# Altium project CommsBoard.PrjPcb
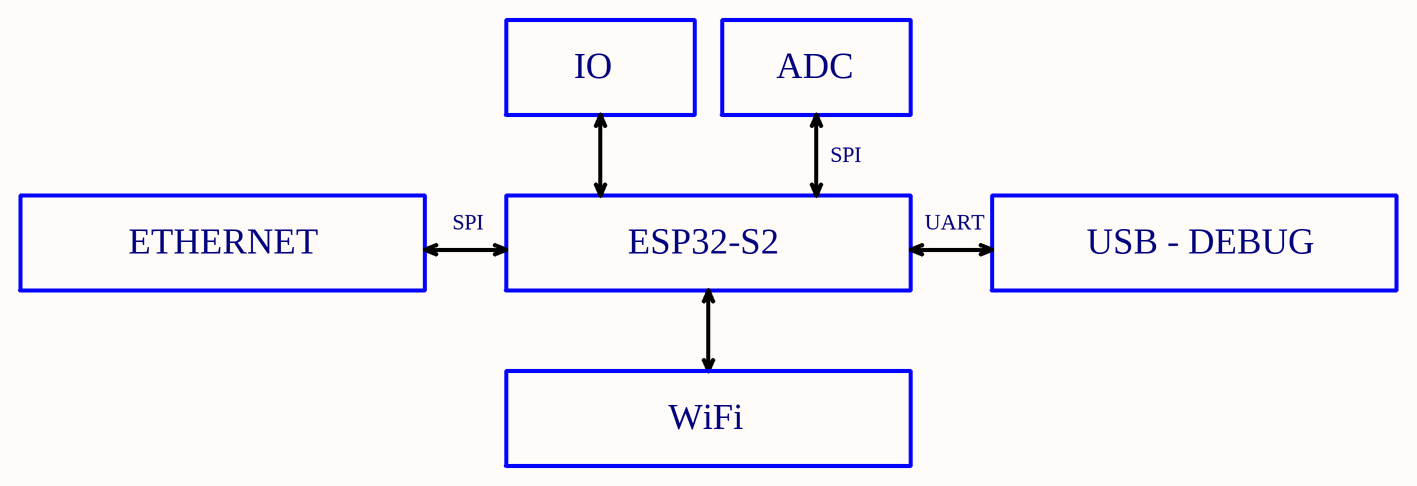
[diagram p0: 01_Block_Diagram.SchDoc]
8 sheets, 168 parts. Net scope: flat (ports and power ports of the same name join across sheets).
Board file: v1.0.PcbDoc
Sheets:
  01_Block_Diagram.SchDoc
  02_Power_Diagram.SchDoc
  03_MCU_ESP32_Interface.SchDoc
  04_ESP32_UART.SchDoc
  05_Ethernet_Interface.SchDoc
  06_Power_Supply.SchDoc
  07_ADC.SchDoc
  08_IO.SchDoc

## Sheet 01_Block_Diagram.SchDoc
size A4; SheetNumber: 1; SheetTotal: 8

### Notes on the sheet
- IO
- ADC
- SPI
- ETHERNET
- ESP32-S2
- UART
- USB - DEBUG
- WiFi

## Sheet 02_Power_Diagram.SchDoc
size A4; SheetNumber: 1; SheetTotal: 8
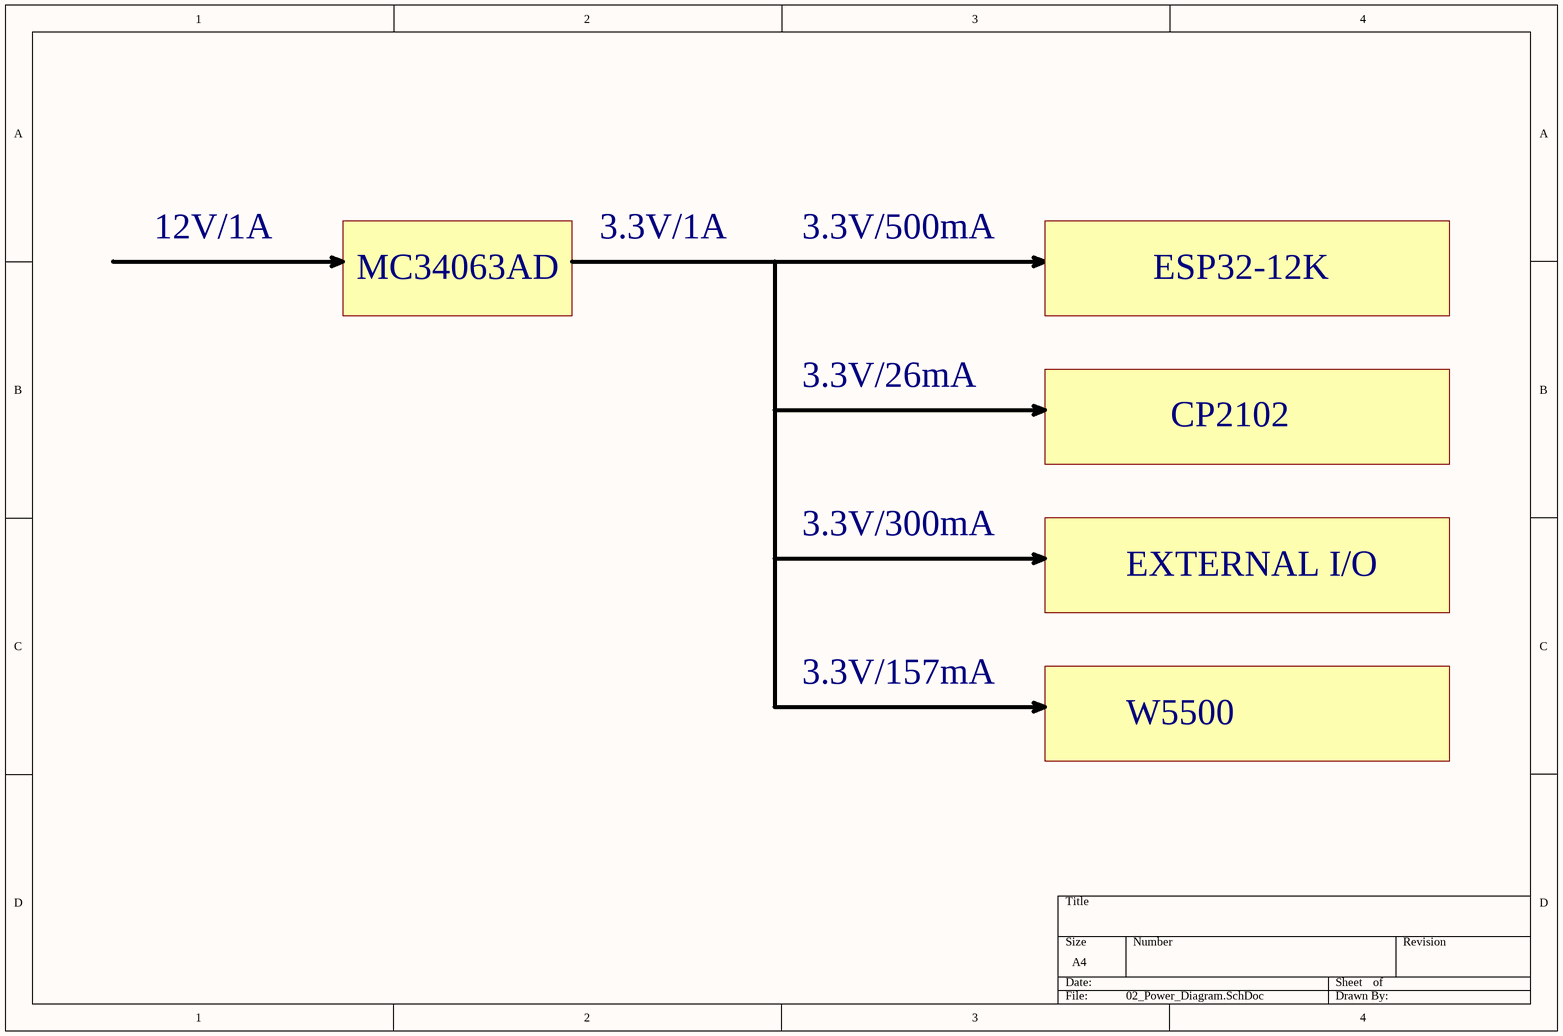
[diagram p1: 02_Power_Diagram.SchDoc]

### Notes on the sheet
- 12V/1A
- 3.3V/1A
- 3.3V/500mA
- MC34063AD
- ESP32-12K
- 3.3V/26mA
- CP2102
- 3.3V/300mA
- EXTERNAL I/O
- 3.3V/157mA
- W5500

## Sheet 03_MCU_ESP32_Interface.SchDoc
size A4; SheetNumber: 4; SheetTotal: 9
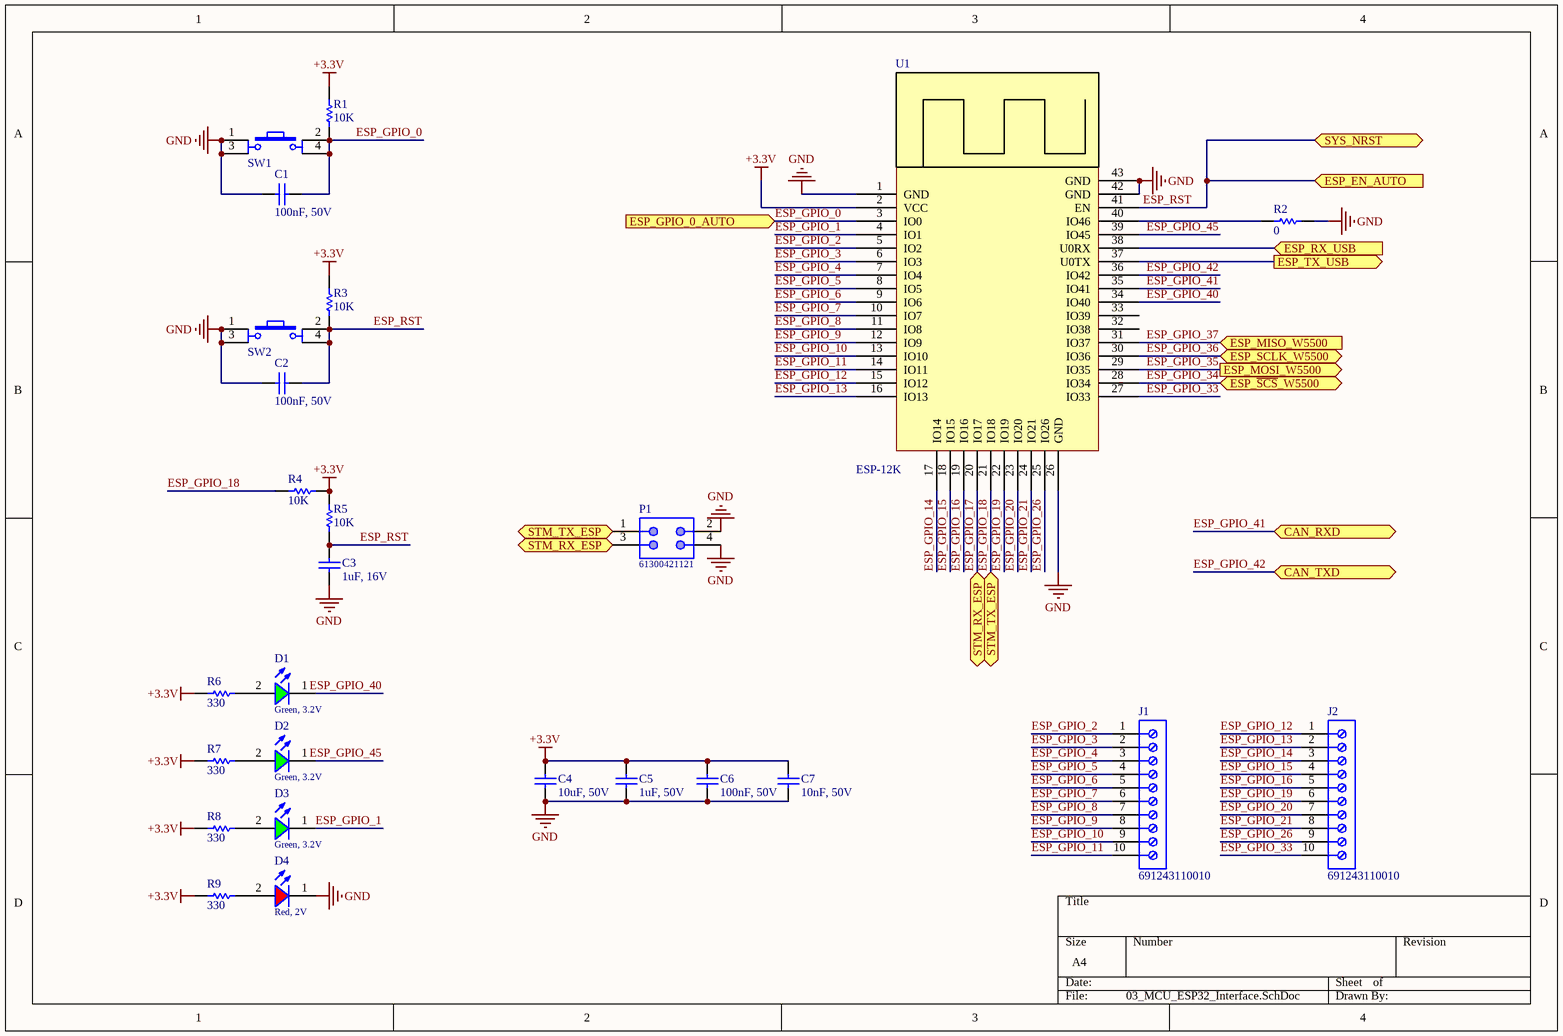
[diagram p2: 03_MCU_ESP32_Interface.SchDoc]

### Parts
(Parts that share a designator on the sheet are numbered #1, #2 ... from top to bottom, then left to right.)
C1  100nF, 50V  [WCAP-CSGP_0603_H=0.8mm_Reflow]
C2  100nF, 50V  [WCAP-CSGP_0603_H=0.8mm_Reflow]
C3  1uF, 16V  [WCAP-CSGP_0603_H=0.8mm_Reflow]
C4  10uF, 50V  [WCAP-CSGP_0603_H=0.8mm_Reflow]
C5  1uF, 50V  [WCAP-CSGP_0603_H=0.8mm_Reflow]
C6  100nF, 50V  [WCAP-CSGP_0603_H=0.8mm_Reflow]
C7  10nF, 50V  [WCAP-CSGP_0603_H=0.8mm_Reflow]
D1  Green, 3.2V  [WL-SMCW_0603_H=0.7mm]
D2  Green, 3.2V  [WL-SMCW_0603_H=0.7mm]
D3  Green, 3.2V  [WL-SMCW_0603_H=0.7mm]
D4  Red, 2V  [WL-SMCW_0603_H=0.7mm]
J1#1  691243110010  [691243110010]
J2#1  691243110010  [691243110010]
P1  61300421121  [61300421121]
R1  value 10K  [RES-SM-0603]  (hidden comment: RESISTOR SMD)
R2  value 0  [RES-SM-0603]  (hidden comment: RESISTOR SMD)
R3  value 10K  [RES-SM-0603]  (hidden comment: RESISTOR SMD)
R4  value 10K  [RES-SM-0603]  (hidden comment: RESISTOR SMD)
R5  value 10K  [RES-SM-0603]  (hidden comment: RESISTOR SMD)
R6  value 330  [RES-SM-0603]  (hidden comment: RESISTOR SMD)
R7  value 330  [RES-SM-0603]  (hidden comment: RESISTOR SMD)
R8  value 330  [RES-SM-0603]  (hidden comment: RESISTOR SMD)
R9  value 330  [RES-SM-0603]  (hidden comment: RESISTOR SMD)
SW1  SW  [Tact SW 4 pin]  (value not drawn)
SW2  SW  [Tact SW 4 pin]  (value not drawn)
U1  ESP-12K  [CAC-150P3100X1800-41N]

### Ports
CAN_RXD (bidir), CAN_TXD (bidir), ESP_EN_AUTO (in), ESP_GPIO_0_AUTO (in), ESP_MISO_W5500 (in), ESP_MOSI_W5500 (out), ESP_RX_USB (in), ESP_SCLK_W5500 (bidir), ESP_TX_USB (out), ESP_~{SCS}_W5500 (bidir), STM_RX_ESP (bidir), STM_TX_ESP (bidir), SYS_NRST (bidir)

### Nets
+3.3V: C4.2 C5.2 C6.2 C7.2 R1.2 R3.2 R4.2 R5.2 R6.2 R7.2 R8.2 R9.2 U1.2(VCC)
GND: C1.1 C2.1 C3.1 C4.1 C5.1 C6.1 C7.1 D4.1(K) P1.2 P1.4 R2.2 SW1.1 SW1.3 SW2.1 SW2.3 U1.1(GND) U1.26(GND) U1.42(GND) U1.43(GND)
ESP_GPIO_0: C1.2 R1.1 SW1.2 SW1.4 U1.3(IO0) ; port ESP_GPIO_0_AUTO
ESP_GPIO_1: D3.1(K) U1.4(IO1)
ESP_GPIO_2: J1#1.1 U1.5(IO2)
ESP_GPIO_3: J1#1.2 U1.6(IO3)
ESP_GPIO_4: J1#1.3 U1.7(IO4)
ESP_GPIO_5: J1#1.4 U1.8(IO5)
ESP_GPIO_6: J1#1.5 U1.9(IO6)
ESP_GPIO_7: J1#1.6 U1.10(IO7)
ESP_GPIO_8: J1#1.7 U1.11(IO8)
ESP_GPIO_9: J1#1.8 U1.12(IO9)
ESP_GPIO_10: J1#1.9 U1.13(IO10)
ESP_GPIO_11: J1#1.10 U1.14(IO11)
ESP_GPIO_12: J2#1.1 U1.15(IO12)
ESP_GPIO_13: J2#1.2 U1.16(IO13)
ESP_GPIO_14: J2#1.3 U1.17(IO14)
ESP_GPIO_15: J2#1.4 U1.18(IO15)
ESP_GPIO_16: J2#1.5 U1.19(IO16)
ESP_GPIO_17: P1.3 U1.20(IO17) ; port STM_RX_ESP
ESP_GPIO_18: P1.1 R4.1 U1.21(IO18) ; port STM_TX_ESP
ESP_GPIO_19: J2#1.6 U1.22(IO19)
ESP_GPIO_20: J2#1.7 U1.23(IO20)
ESP_GPIO_21: J2#1.8 U1.24(IO21)
ESP_GPIO_26: J2#1.9 U1.25(IO26)
ESP_GPIO_33: J2#1.10 U1.27(IO33)
ESP_GPIO_34: U1.28(IO34) ; port ESP_~{SCS}_W5500
ESP_GPIO_35: U1.29(IO35) ; port ESP_MOSI_W5500
ESP_GPIO_36: U1.30(IO36) ; port ESP_SCLK_W5500
ESP_GPIO_37: U1.31(IO37) ; port ESP_MISO_W5500
ESP_GPIO_40: D1.1(K) U1.34(IO40)
ESP_GPIO_41: U1.35(IO41) ; port CAN_RXD
ESP_GPIO_42: U1.36(IO42) ; port CAN_TXD
ESP_GPIO_45: D2.1(K) U1.39(IO45)
ESP_RST: C2.2 C3.2 R3.1 R5.1 SW2.2 SW2.4 U1.41(EN) ; port ESP_EN_AUTO, port SYS_NRST
NetD1_2: D1.2(A) R6.1
NetD2_2: D2.2(A) R7.1
NetD3_2: D3.2(A) R8.1
NetD4_2: D4.2(A) R9.1
NetR2_1: R2.1 U1.40(IO46)
NetU1_37: U1.37(U0TX) ; port ESP_TX_USB
NetU1_38: U1.38(U0RX) ; port ESP_RX_USB

Not connected (* = marked no-connect by the designer): U1 32(IO38) 33(IO39)

### Library data of the parts
C1 C2 C4-C6 = 885012206095: WCAP-CSGP Multilayer Ceramic Chip Capacitor, General Purpose, size 0603, X7R, 100nF, 50V; Manufacturer: Wurth Elektronik; Rated Voltage: 50VDC; Isolation Resistance: >=5GOhm; Capacitance Tolerance: +/-10%; Technical Reference: X7R0603104K050DFCT10000; ComponentLink1Description: Manufacturer; ComponentLink1URL: http://www.we-online.de; ComponentLink2Description: Datasheet; ComponentLink2URL: https://www.we-online.com/catalog/datasheet/885012206095.pdf; Operating Temperature: -55 to +125degC; Packaging: Tape and Reel; Manufacturer Part Number: 885012206095; Published Date: May 2020; Ceramic Type: X7R; Dissipation Factor: =<3%; Height: 0.8mm; Mounting Technology: SMT; Size: 0603; Capacitance: 100nF
C3 = 885012106017: WCAP-CSGP Multilayer Ceramic Chip Capacitor, General Purpose, size 0603, X5R, 1uF, 16V; Manufacturer: Wurth Elektronik; Rated Voltage: 16VDC; Isolation Resistance: >=0.1GOhm; Capacitance Tolerance: +/-20%; Technical Reference: X5R0603105M016DFCT10000; ComponentLink1Description: Manufacturer; ComponentLink1URL: http://www.we-online.de; ComponentLink2Description: Datasheet; ComponentLink2URL: https://www.we-online.com/catalog/datasheet/885012106017.pdf; Operating Temperature: -55 to +85degC; Packaging: Tape and Reel; Manufacturer Part Number: 885012106017; Published Date: May 2020; Ceramic Type: X5R; Dissipation Factor: =<10%; Height: 0.8mm; Mounting Technology: SMT; Size: 0603; Capacitance: 1uF
C7 = 885012206089: WCAP-CSGP Multilayer Ceramic Chip Capacitor, General Purpose, size 0603, X7R, 10nF, 50V; Manufacturer: Wurth Elektronik; Rated Voltage: 50VDC; Isolation Resistance: >=10GOhm; Capacitance Tolerance: +/-10%; Technical Reference: X7R0603103K050DFCT10000; ComponentLink1Description: Manufacturer; ComponentLink1URL: http://www.we-online.de; ComponentLink2Description: Datasheet; ComponentLink2URL: https://www.we-online.com/catalog/datasheet/885012206089.pdf; Operating Temperature: -55 to +125degC; Packaging: Tape and Reel; Manufacturer Part Number: 885012206089; Published Date: May 2020; Ceramic Type: X7R; Dissipation Factor: =<2.5%; Height: 0.8mm; Mounting Technology: SMT; Size: 0603; Capacitance: 10nF
D1-D3 = 150060GS75000: WL-SMCW SMT Mono-color Chip LED Waterclear, size 0603, Green, 3.2V, 140deg; Chip Technology: InGaN; Dominant Wavelength typ.: 525nm; Luminous Intensity typ.: 430mcd; Peak Wavelength typ.: 515nm; Viewing Angle: 140deg; ComponentLink1Description: Manufacturer; ComponentLink1URL: http://www.we-online.de; ComponentLink2URL: https://www.we-online.com/catalog/datasheet/150060GS75000.pdf; ComponentLink2Description: Datasheet; Forward Voltage typ.: 3.2V; Emitting Color: Green; Mounting Technology: SMT; Operating Temperature: -40 to +85degC; Published Date: December 2019; Part Number: 150060GS75000; Packaging: Tape and Reel; Size: 0603; Publisher: Wurth Elektronik
D4 = 150060RS75000: WL-SMCW SMT Mono-color Chip LED Waterclear, size 0603, Red, 2V, 140deg; Chip Technology: AlInGaP; Dominant Wavelength typ.: 625nm; Luminous Intensity typ.: 250mcd; Peak Wavelength typ.: 630nm; Viewing Angle: 140deg; ComponentLink1Description: Manufacturer; ComponentLink1URL: http://www.we-online.de; ComponentLink2URL: https://www.we-online.com/catalog/datasheet/150060RS75000.pdf; ComponentLink2Description: Datasheet; Forward Voltage typ.: 2V; Emitting Color: Red; Mounting Technology: SMT; Operating Temperature: -40 to +85degC; Published Date: December 2019; Part Number: 150060RS75000; Packaging: Tape and Reel; Size: 0603; Publisher: Wurth Elektronik
J1#1 J2#1 = 691243110010: WR-TBL Serie 2431 Horizontal Cable Entry, Rising Cage Clamp, pitch 3.5mm, 10p; Compliance: Lead free / RoHS; Modularity: No; PCB/Cable/Panel: PCB; Pin Number: 10; Rated Current [UL]: 10A; Working Voltage [UL]: 300VAC; ComponentLink1Description: Manufacturer; ComponentLink1URL: http://www.we-online.de; ComponentLink2URL: https://katalog.we-online.de/em/datasheet/691243110010.pdf; ComponentLink2Description: Datasheet; Mounting Technology: THT; Part Number: 691243110010; Packaging: Box; Operating Temperature: -30 to +120degC; Pitch: 3.5mm; Published Date: October 2019; Type: Horizontal; Publisher: Wurth Elektronik; Application: Rising Cage Clamp
P1 = 61300421121: WR-PHD Pin Header, THT, pitch 2.54mm, Dual Row, Vertical, 4p; Manufacturer: Wurth Elektronik; Pin Number: 4; Rated Current: 3A; Working Voltage: 250VAC; Withstanding Voltage: 500VAC; Contact Resistance: 20mOhm; ComponentLink1Description: Manufacturer; ComponentLink1URL: http://www.we-online.de; ComponentLink2Description: Datasheet; ComponentLink2URL: https://www.we-online.com/catalog/datasheet/61300421121.pdf; Manufacturer Part Number: 61300421121; Published Date: May 2020; Pitch: 2.54mm; Operating Temperature: -40 to +105degC; Mounting Technology: THT; Packaging: Bag; Gender: Pin Header; Row Number: Dual; Orientation: Vertical
R1-R9 = RESISTOR SMD: Resistor
SW1 SW2 = Tact SW - 4Pin: Switch button 4 pin; Value: Button chip 4 pin
U1 = ESP-12K: ESP32-S2

## Sheet 04_ESP32_UART.SchDoc
size A4; SheetNumber: 3; SheetTotal: 7
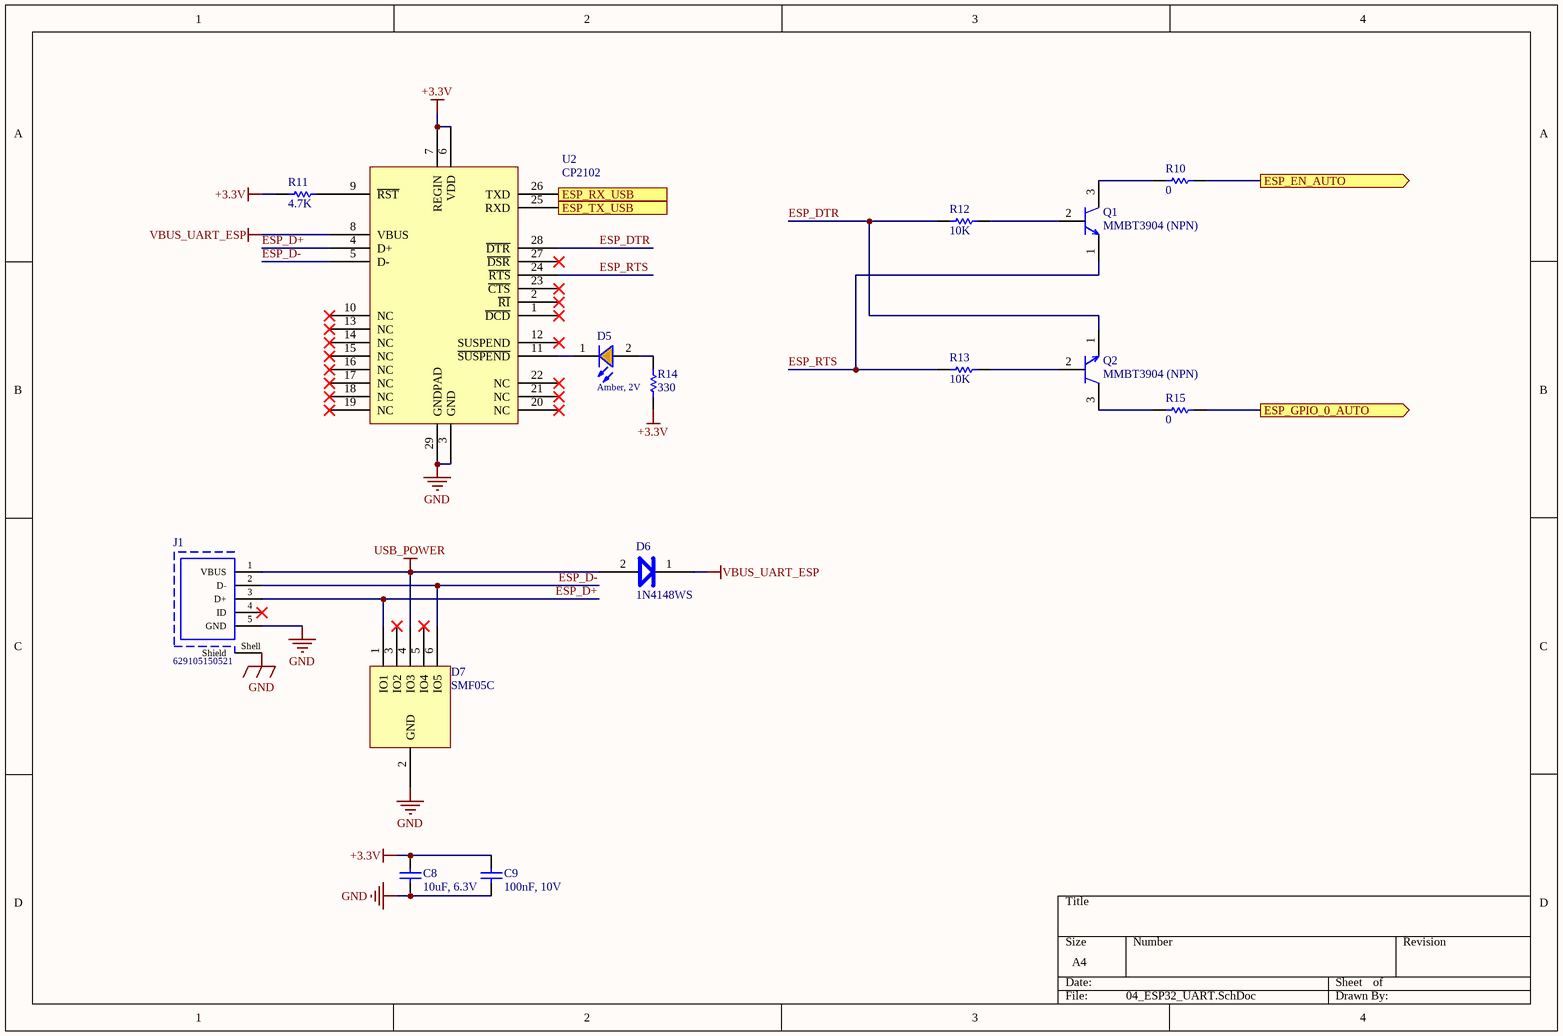
[diagram p3: 04_ESP32_UART.SchDoc]

### Parts
(Parts that share a designator on the sheet are numbered #1, #2 ... from top to bottom, then left to right.)
C8  10uF, 6.3V  [WCAP-CSGP_0603_H=0.8mm_Reflow]
C9  100nF, 10V  [WCAP-CSGP_0603_H=0.8mm_Reflow]
D5  Amber, 2V  [WL-SMCW_0603_H=0.7mm]
D6  1N4148WS  [SODFL250X90-2N]
D7  SMF05C  [SOT65P210X110-6N]
J1#2  629105150521  [629105150521]
Q1  MMBT3904 (NPN)  [SOT95P245X110-3N]
Q2  MMBT3904 (NPN)  [SOT95P245X110-3N]
R10  value 0  [RES-SM-0603]  (hidden comment: RESISTOR SMD)
R11  value 4.7K  [RES-SM-0603]  (hidden comment: RESISTOR SMD)
R12  value 10K  [RES-SM-0603]  (hidden comment: RESISTOR SMD)
R13  value 10K  [RES-SM-0603]  (hidden comment: RESISTOR SMD)
R14  value 330  [RES-SM-0603]  (hidden comment: RESISTOR SMD)
R15  value 0  [RES-SM-0603]  (hidden comment: RESISTOR SMD)
U2  CP2102  [QFN50P500X500X90_HS-29N]

### Ports
ESP_EN_AUTO (out), ESP_GPIO_0_AUTO (out), ESP_RX_USB (out), ESP_TX_USB (in)

### Nets
+3.3V: C8.2 C9.2 R11.2 R14.2 U2.6(VDD) U2.7(REGIN)
GND: C8.1 C9.1 D7.2(GND) J1#2.5(GND) J1#2.Shell(Shield) U2.3(GND) U2.29(GNDPAD)
USB_POWER: D6.2 D7.4(IO3) J1#2.1(VBUS)
VBUS_UART_ESP: D6.1 U2.8(VBUS)
ESP_D+: D7.1(IO1) J1#2.3(D+) U2.4(D+)
ESP_D-: D7.6(IO5) J1#2.2(D-) U2.5(D-)
ESP_DTR: Q2.1 R12.1 U2.28(~{DTR})
ESP_GPIO_0: R15.2 ; port ESP_GPIO_0_AUTO
ESP_RST: R10.2 ; port ESP_EN_AUTO
ESP_RTS: Q1.1 R13.1 U2.24(~{RTS})
NetD5_1: D5.1(K) U2.11(~{SUSPEND})
NetD5_2: D5.2(A) R14.1
NetQ1_2: Q1.2 R12.2
NetQ1_3: Q1.3 R10.1
NetQ2_2: Q2.2 R13.2
NetQ2_3: Q2.3 R15.1
NetR11_1: R11.1 U2.9(~{RST})
NetU1_37: U2.25(RXD) ; port ESP_TX_USB
NetU1_38: U2.26(TXD) ; port ESP_RX_USB

Not connected (* = marked no-connect by the designer): D7 3(IO2)* 5(IO4)*; J1#2 4(ID)*; U2 1(~{DCD})* 2(~{RI})* 10(NC)* 12(SUSPEND)* 13(NC)* 14(NC)* 15(NC)* 16(NC)* 17(NC)* 18(NC)* 19(NC)* 20(NC)* 21(NC)* 22(NC)* 23(~{CTS})* 27(~{DSR})*

### Library data of the parts
C8 = 885012106006: WCAP-CSGP Multilayer Ceramic Chip Capacitor, General Purpose, size 0603, X5R, 10uF, 6.3V; Manufacturer: Wurth Elektronik; Rated Voltage: 6.3VDC; Isolation Resistance: >=0.01GOhm; Capacitance Tolerance: +/-20%; Technical Reference: X5R0603106M6R3DFCT10000; ComponentLink1Description: Manufacturer; ComponentLink1URL: http://www.we-online.de; ComponentLink2Description: Datasheet; ComponentLink2URL: https://www.we-online.com/catalog/datasheet/885012106006.pdf; Operating Temperature: -55 to +85degC; Packaging: Tape and Reel; Manufacturer Part Number: 885012106006; Published Date: May 2020; Ceramic Type: X5R; Dissipation Factor: =<10%; Height: 0.8mm; Mounting Technology: SMT; Size: 0603; Capacitance: 10uF
C9 = 885012206020: WCAP-CSGP Multilayer Ceramic Chip Capacitor, General Purpose, size 0603, X7R, 100nF, 10V; Manufacturer: Wurth Elektronik; Rated Voltage: 10VDC; Isolation Resistance: >=5GOhm; Capacitance Tolerance: +/-10%; Technical Reference: X7R0603104K010DFCT10000; ComponentLink1Description: Manufacturer; ComponentLink1URL: http://www.we-online.de; ComponentLink2Description: Datasheet; ComponentLink2URL: https://www.we-online.com/catalog/datasheet/885012206020.pdf; Operating Temperature: -55 to +125degC; Packaging: Tape and Reel; Manufacturer Part Number: 885012206020; Published Date: May 2020; Ceramic Type: X7R; Dissipation Factor: =<5%; Height: 0.8mm; Mounting Technology: SMT; Size: 0603; Capacitance: 100nF
D5 = 150060AS75000: WL-SMCW SMT Mono-color Chip LED Waterclear, size 0603, Amber, 2V, 140deg; Chip Technology: AlInGaP; Dominant Wavelength typ.: 605nm; Luminous Intensity typ.: 130mcd; Peak Wavelength typ.: 610nm; Viewing Angle: 140deg; ComponentLink1Description: Manufacturer; ComponentLink1URL: http://www.we-online.de; ComponentLink2URL: https://www.we-online.com/catalog/datasheet/150060AS75000.pdf; ComponentLink2Description: Datasheet; Forward Voltage typ.: 2V; Emitting Color: Amber; Mounting Technology: SMT; Operating Temperature: -40 to +85degC; Published Date: December 2019; Part Number: 150060AS75000; Packaging: Tape and Reel; Size: 0603; Publisher: Wurth Elektronik
J1#2 = 629105150521: Micro USB 2.0 Type B Receptacle WR-COM, Horizontal, SMT, with Pegs, High Current at Pin 1 & Pin 5; Rated Current: 3 A; Contact Resistance: 30 mOhm; Working Voltage: 30 VAC; ComponentLink1Description: Manufacturer; ComponentLink1URL: http://www.we-online.de; ComponentLink2Description: Datasheet; ComponentLink2URL: https://katalog.we-online.de/em/datasheet/629105150521.pdf; Part Number: 629105150521; Published Date: September 2018; Publisher: Wurth Elektronik; Orientation: Horizontal; Connector Type: Micro USB 2.0 Type B; Operating Temperature: -40 to 85 degC; Mounting Technology: SMT; Gender: Receptacle; Packaging: Tape and Reel
Q1 Q2 = MMBT3904 (NPN): Manufacturer: On Semiconductor; ComponentLink1Description: Local link; ComponentLink1URL: https://www.thegioiic.com/products/mmbt3904-1am; Local supplier: thegioiic; Local supplier PN: MMBT3904-1AM; Manufacturer P/N: MMBT3904
R10-R15 = RESISTOR SMD: Resistor

## Sheet 05_Ethernet_Interface.SchDoc
size A4; SheetNumber: 4; SheetTotal: 7
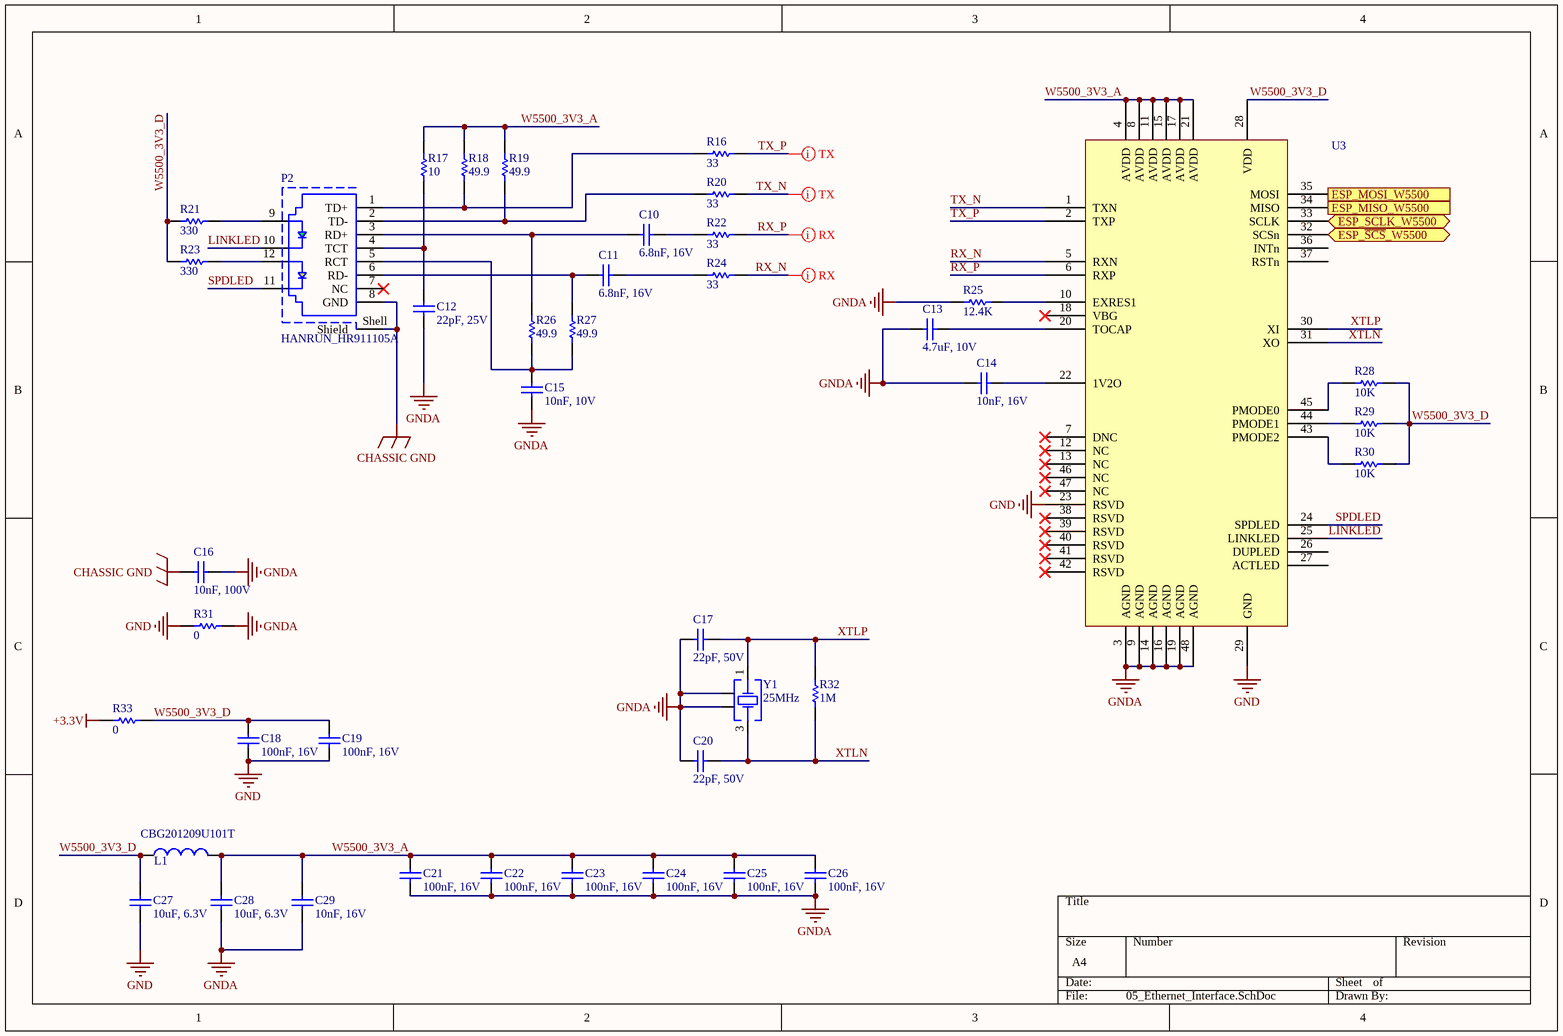
[diagram p4: 05_Ethernet_Interface.SchDoc]

### Parts
C10  6.8nF, 16V  [WCAP-CSGP_0603_H=0.8mm_Reflow]
C11  6.8nF, 16V  [WCAP-CSGP_0603_H=0.8mm_Reflow]
C12  22pF, 25V  [WCAP-CSGP_0603_H=0.8mm_Reflow]
C13  4.7uF, 10V  [WCAP-CSGP_0603_H=0.8mm_Reflow]
C14  10nF, 16V  [WCAP-CSGP_0603_H=0.8mm_Reflow]
C15  10nF, 10V  [WCAP-CSGP_0603_H=0.8mm_Reflow]
C16  10nF, 100V  [WCAP-CSGP_0603_H=0.8mm_Reflow]
C17  22pF, 50V  [WCAP-CSGP_0603_H=0.8mm_Reflow]
C18  100nF, 16V  [WCAP-CSGP_0603_H=0.8mm_Reflow]
C19  100nF, 16V  [WCAP-CSGP_0603_H=0.8mm_Reflow]
C20  22pF, 50V  [WCAP-CSGP_0603_H=0.8mm_Reflow]
C21  100nF, 16V  [WCAP-CSGP_0603_H=0.8mm_Reflow]
C22  100nF, 16V  [WCAP-CSGP_0603_H=0.8mm_Reflow]
C23  100nF, 16V  [WCAP-CSGP_0603_H=0.8mm_Reflow]
C24  100nF, 16V  [WCAP-CSGP_0603_H=0.8mm_Reflow]
C25  100nF, 16V  [WCAP-CSGP_0603_H=0.8mm_Reflow]
C26  100nF, 16V  [WCAP-CSGP_0603_H=0.8mm_Reflow]
C27  10uF, 6.3V  [WCAP-CSGP_0603_H=0.8mm_Reflow]
C28  10uF, 6.3V  [WCAP-CSGP_0603_H=0.8mm_Reflow]
C29  10nF, 16V  [WCAP-CSGP_0603_H=0.8mm_Reflow]
L1  CBG201209U101T  [I0805]
P2  HANRUN_HR911105A  [HANRUN_HR911105A]
R16  value 33  [R0603]  (hidden comment: Resistor)
R17  value 10  [R0603]  (hidden comment: Resistor)
R18  value 49.9  [R0603]  (hidden comment: Resistor)
R19  value 49.9  [R0603]  (hidden comment: Resistor)
R20  value 33  [R0603]  (hidden comment: Resistor)
R21  value 330  [R0603]  (hidden comment: Resistor)
R22  value 33  [R0603]  (hidden comment: Resistor)
R23  value 330  [R0603]  (hidden comment: Resistor)
R24  value 33  [R0603]  (hidden comment: Resistor)
R25  value 12.4K  [R0603]  (hidden comment: Resistor)
R26  value 49.9  [R0603]  (hidden comment: Resistor)
R27  value 49.9  [R0603]  (hidden comment: Resistor)
R28  value 10K  [R0603]  (hidden comment: Resistor)
R29  value 10K  [R0603]  (hidden comment: Resistor)
R30  value 10K  [R0603]  (hidden comment: Resistor)
R31  value 0  [R0603]  (hidden comment: Resistor)
R32  value 1M  [R0603]  (hidden comment: Resistor)
R33  value 0  [R0805]  (hidden comment: Resistor)
U3  W5500  [TSQFP50P900X900X160-48N]  (value not drawn)
Y1  25MHz  [WE-XTAL_CFPX-180]

### Ports
ESP_MISO_W5500 (out), ESP_MOSI_W5500 (in), ESP_SCLK_W5500 (bidir), ESP_~{SCS}_W5500 (bidir)

### Nets
+3.3V: R33.2
CHASSIC GND: C16.1 P2.8(GND) P2.Shell(Shield)
GND: C18.1 C19.1 C27.1 R31.2 U3.23(RSVD) U3.29(GND)
GNDA: C12.1 C13.1 C14.2 C15.1 C16.2 C17.1 C20.1 C21.1 C22.1 C23.1 C24.1 C25.1 C26.1 C28.1 C29.1 R25.2 R31.1 U3.3(AGND) U3.9(AGND) U3.14(AGND) U3.16(AGND) U3.19(AGND) U3.48(AGND) Y1.2(GND&Lid) Y1.4(GND&Lid)
ESP_GPIO_34: U3.32(SCSn) ; port ESP_~{SCS}_W5500
ESP_GPIO_35: U3.35(MOSI) ; port ESP_MOSI_W5500
ESP_GPIO_36: U3.33(SCLK) ; port ESP_SCLK_W5500
ESP_GPIO_37: U3.34(MISO) ; port ESP_MISO_W5500
LINKLED: P2.10 U3.25(LINKLED)
RX_N: R24.1 U3.5(RXN)
RX_P: R22.1 U3.6(RXP)
SPDLED: P2.11 U3.24(SPDLED)
TX_N: R20.1 U3.1(TXN)
TX_P: R16.1 U3.2(TXP)
W5500_3V3_A: C21.2 C22.2 C23.2 C24.2 C25.2 C26.2 C28.2 C29.2 L1.2 R17.2 R18.2 R19.2 U3.4(AVDD) U3.8(AVDD) U3.11(AVDD) U3.15(AVDD) U3.17(AVDD) U3.21(AVDD)
W5500_3V3_D: C18.2 C19.2 C27.2 L1.1 R21.2 R23.2 R28.2 R29.2 R30.2 R33.1 U3.28(VDD)
XTLN: C20.2 R32.1 U3.31(XO) Y1.3(Crystal)
XTLP: C17.2 R32.2 U3.30(XI) Y1.1(Crystal)
NetC10_1: C10.1 P2.3(RD+) R26.1
NetC10_2: C10.2 R22.2
NetC11_1: C11.1 P2.6(RD-) R27.1
NetC11_2: C11.2 R24.2
NetC12_2: C12.2 P2.4(TCT) R17.1
NetC13_2: C13.2 U3.20(TOCAP)
NetC14_1: C14.1 U3.22(1V2O)
NetC15_2: C15.2 P2.5(RCT) R26.2 R27.2
NetP2_1: P2.1(TD+) R16.2 R18.1
NetP2_2: P2.2(TD-) R19.1 R20.2
NetP2_9: P2.9 R21.1
NetP2_12: P2.12 R23.1
NetR25_1: R25.1 U3.10(EXRES1)
NetR28_1: R28.1 U3.45(PMODE0)
NetR29_1: R29.1 U3.44(PMODE1)
NetR30_1: R30.1 U3.43(PMODE2)

Not connected (* = marked no-connect by the designer): P2 7(NC)*; U3 7(DNC)* 12(NC)* 13(NC)* 18(VBG)* 26(DUPLED) 27(ACTLED) 36(INTn) 37(RSTn) 38(RSVD)* 39(RSVD)* 40(RSVD)* 41(RSVD)* 42(RSVD)* 46(NC)* 47(NC)*

### Layout directives
differential pair: RX_N, RX_P, TX_N, TX_P

### Library data of the parts
C10 C11 = 885012206039: WCAP-CSGP Multilayer Ceramic Chip Capacitor, General Purpose, size 0603, X7R, 6.8nF, 16V; Manufacturer: Wurth Elektronik; Rated Voltage: 16VDC; Isolation Resistance: >=10GOhm; Capacitance Tolerance: +/-10%; Technical Reference: X7R0603682K016DFCT10000; ComponentLink1Description: Manufacturer; ComponentLink1URL: http://www.we-online.de; ComponentLink2Description: Datasheet; ComponentLink2URL: https://www.we-online.com/catalog/datasheet/885012206039.pdf; Operating Temperature: -55 to +125degC; Packaging: Tape and Reel; Manufacturer Part Number: 885012206039; Published Date: May 2020; Ceramic Type: X7R; Dissipation Factor: =<3.5%; Height: 0.8mm; Mounting Technology: SMT; Size: 0603; Capacitance: 6.8nF
C12 = 885012006034: WCAP-CSGP Multilayer Ceramic Chip Capacitor, General Purpose, size 0603, NP0, 22pF, 25V; Manufacturer: Wurth Elektronik; Rated Voltage: 25VDC; Isolation Resistance: >=10GOhm; Capacitance Tolerance: +/-5%; Dissipation Factor: Q>=400+20C; Technical Reference: NP00603220J025DFCT10000; ComponentLink1Description: Manufacturer; ComponentLink1URL: http://www.we-online.de; ComponentLink2Description: Datasheet; ComponentLink2URL: https://www.we-online.com/catalog/datasheet/885012006034.pdf; Operating Temperature: -55 to +125degC; Packaging: Tape and Reel; Manufacturer Part Number: 885012006034; Published Date: May 2020; Ceramic Type: NP0; Height: 0.8mm; Mounting Technology: SMT; Size: 0603; Capacitance: 22pF
C13 = 885012106012: WCAP-CSGP Multilayer Ceramic Chip Capacitor, General Purpose, size 0603, X5R, 4.7uF, 10V; Manufacturer: Wurth Elektronik; Rated Voltage: 10VDC; Isolation Resistance: >=0.02GOhm; Capacitance Tolerance: +/-20%; Technical Reference: X5R0603475M010DFCT10000; ComponentLink1Description: Manufacturer; ComponentLink1URL: http://www.we-online.de; ComponentLink2Description: Datasheet; ComponentLink2URL: https://www.we-online.com/catalog/datasheet/885012106012.pdf; Operating Temperature: -55 to +85degC; Packaging: Tape and Reel; Manufacturer Part Number: 885012106012; Published Date: May 2020; Ceramic Type: X5R; Dissipation Factor: =<10%; Height: 0.8mm; Mounting Technology: SMT; Size: 0603; Capacitance: 4.7uF
C14 C29 = 885012206040: WCAP-CSGP Multilayer Ceramic Chip Capacitor, General Purpose, size 0603, X7R, 10nF, 16V; Manufacturer: Wurth Elektronik; Rated Voltage: 16VDC; Isolation Resistance: >=10GOhm; Capacitance Tolerance: +/-10%; Technical Reference: X7R0603103K016DFCT10000; ComponentLink1Description: Manufacturer; ComponentLink1URL: http://www.we-online.de; ComponentLink2Description: Datasheet; ComponentLink2URL: https://www.we-online.com/catalog/datasheet/885012206040.pdf; Operating Temperature: -55 to +125degC; Packaging: Tape and Reel; Manufacturer Part Number: 885012206040; Published Date: May 2020; Ceramic Type: X7R; Dissipation Factor: =<3.5%; Height: 0.8mm; Mounting Technology: SMT; Size: 0603; Capacitance: 10nF
C15 = 885012206014: WCAP-CSGP Multilayer Ceramic Chip Capacitor, General Purpose, size 0603, X7R, 10nF, 10V; Manufacturer: Wurth Elektronik; Rated Voltage: 10VDC; Isolation Resistance: >=10GOhm; Capacitance Tolerance: +/-10%; Technical Reference: X7R0603103K010DFCT10000; ComponentLink1Description: Manufacturer; ComponentLink1URL: http://www.we-online.de; ComponentLink2Description: Datasheet; ComponentLink2URL: https://www.we-online.com/catalog/datasheet/885012206014.pdf; Operating Temperature: -55 to +125degC; Packaging: Tape and Reel; Manufacturer Part Number: 885012206014; Published Date: May 2020; Ceramic Type: X7R; Dissipation Factor: =<5%; Height: 0.8mm; Mounting Technology: SMT; Size: 0603; Capacitance: 10nF
C16 = 885012206114: WCAP-CSGP Multilayer Ceramic Chip Capacitor, General Purpose, size 0603, X7R, 10nF, 100V; Manufacturer: Wurth Elektronik; Rated Voltage: 100VDC; Isolation Resistance: >=10GOhm; Capacitance Tolerance: +/-10%; Technical Reference: X7R0603103K100DFCT10000; ComponentLink1Description: Manufacturer; ComponentLink1URL: http://www.we-online.de; ComponentLink2Description: Datasheet; ComponentLink2URL: https://www.we-online.com/catalog/datasheet/885012206114.pdf; Operating Temperature: -55 to +125degC; Packaging: Tape and Reel; Manufacturer Part Number: 885012206114; Published Date: May 2020; Ceramic Type: X7R; Dissipation Factor: =<2.5%; Height: 0.8mm; Mounting Technology: SMT; Size: 0603; Capacitance: 10nF
C17 C20 = 885012006053: WCAP-CSGP Multilayer Ceramic Chip Capacitor, General Purpose, size 0603, NP0, 22pF, 50V; Manufacturer: Wurth Elektronik; Rated Voltage: 50VDC; Isolation Resistance: >=10GOhm; Capacitance Tolerance: +/-5%; Dissipation Factor: Q>=400+20C; Technical Reference: NP00603220J050DFCT10000; ComponentLink1Description: Manufacturer; ComponentLink1URL: http://www.we-online.de; ComponentLink2Description: Datasheet; ComponentLink2URL: https://www.we-online.com/catalog/datasheet/885012006053.pdf; Operating Temperature: -55 to +125degC; Packaging: Tape and Reel; Manufacturer Part Number: 885012006053; Published Date: May 2020; Ceramic Type: NP0; Height: 0.8mm; Mounting Technology: SMT; Size: 0603; Capacitance: 22pF
C18 C19 C21-C26 = 885012206046: WCAP-CSGP Multilayer Ceramic Chip Capacitor, General Purpose, size 0603, X7R, 100nF, 16V; Manufacturer: Wurth Elektronik; Rated Voltage: 16VDC; Isolation Resistance: >=5GOhm; Capacitance Tolerance: +/-10%; Technical Reference: X7R0603104K016DFCT10000; ComponentLink1Description: Manufacturer; ComponentLink1URL: http://www.we-online.de; ComponentLink2Description: Datasheet; ComponentLink2URL: https://www.we-online.com/catalog/datasheet/885012206046.pdf; Operating Temperature: -55 to +125degC; Packaging: Tape and Reel; Manufacturer Part Number: 885012206046; Published Date: May 2020; Ceramic Type: X7R; Dissipation Factor: =<3.5%; Height: 0.8mm; Mounting Technology: SMT; Size: 0603; Capacitance: 100nF
C27 C28 = 885012106006: as C8 on sheet 04_ESP32_UART; ComponentLink1Description: Manufacturer; ComponentLink1URL: http://www.we-online.de; ComponentLink2Description: Datasheet; ComponentLink2URL: https://www.we-online.com/catalog/datasheet/885012106006.pdf; Operating Temperature: -55 to +85degC; Packaging: Tape and Reel; Manufacturer Part Number: 885012106006; Published Date: May 2020; Ceramic Type: X5R; Dissipation Factor: =<10%; Height: 0.8mm; Mounting Technology: SMT; Size: 0603; Capacitance: 10uF
L1 = CBG201209U101T: Impedance @ Frequency: 100 Ohm @ 100MHz; Current Rating (Max): 500mA; Value: 100 Ohm
Y1 = 830108340809: WE-XTAL Quartz Crystal, SMT, CFPX-180, 25MHz, +/-20ppm; Manufacturer: Wurth Elektronik; Frequency Stability: +/-30ppm; Load Capacitance: 12pF; ComponentLink1Description: Manufacturer; ComponentLink1URL: http://www.we-online.de; ComponentLink2Description: Datasheet; ComponentLink2URL: https://www.we-online.com/catalog/datasheet/830108340809.pdf; Operating Temperature: -40 to +105degC; Packaging: Tape and Reel; Manufacturer Part Number: 830108340809; Published Date: November 2020; Size: CFPX-180; Frequency: 25MHz; Frequency Tolerance: +/-20ppm; Mounting Technology: SMT

## Sheet 06_Power_Supply.SchDoc
size A4; SheetNumber: 8; SheetTotal: 9
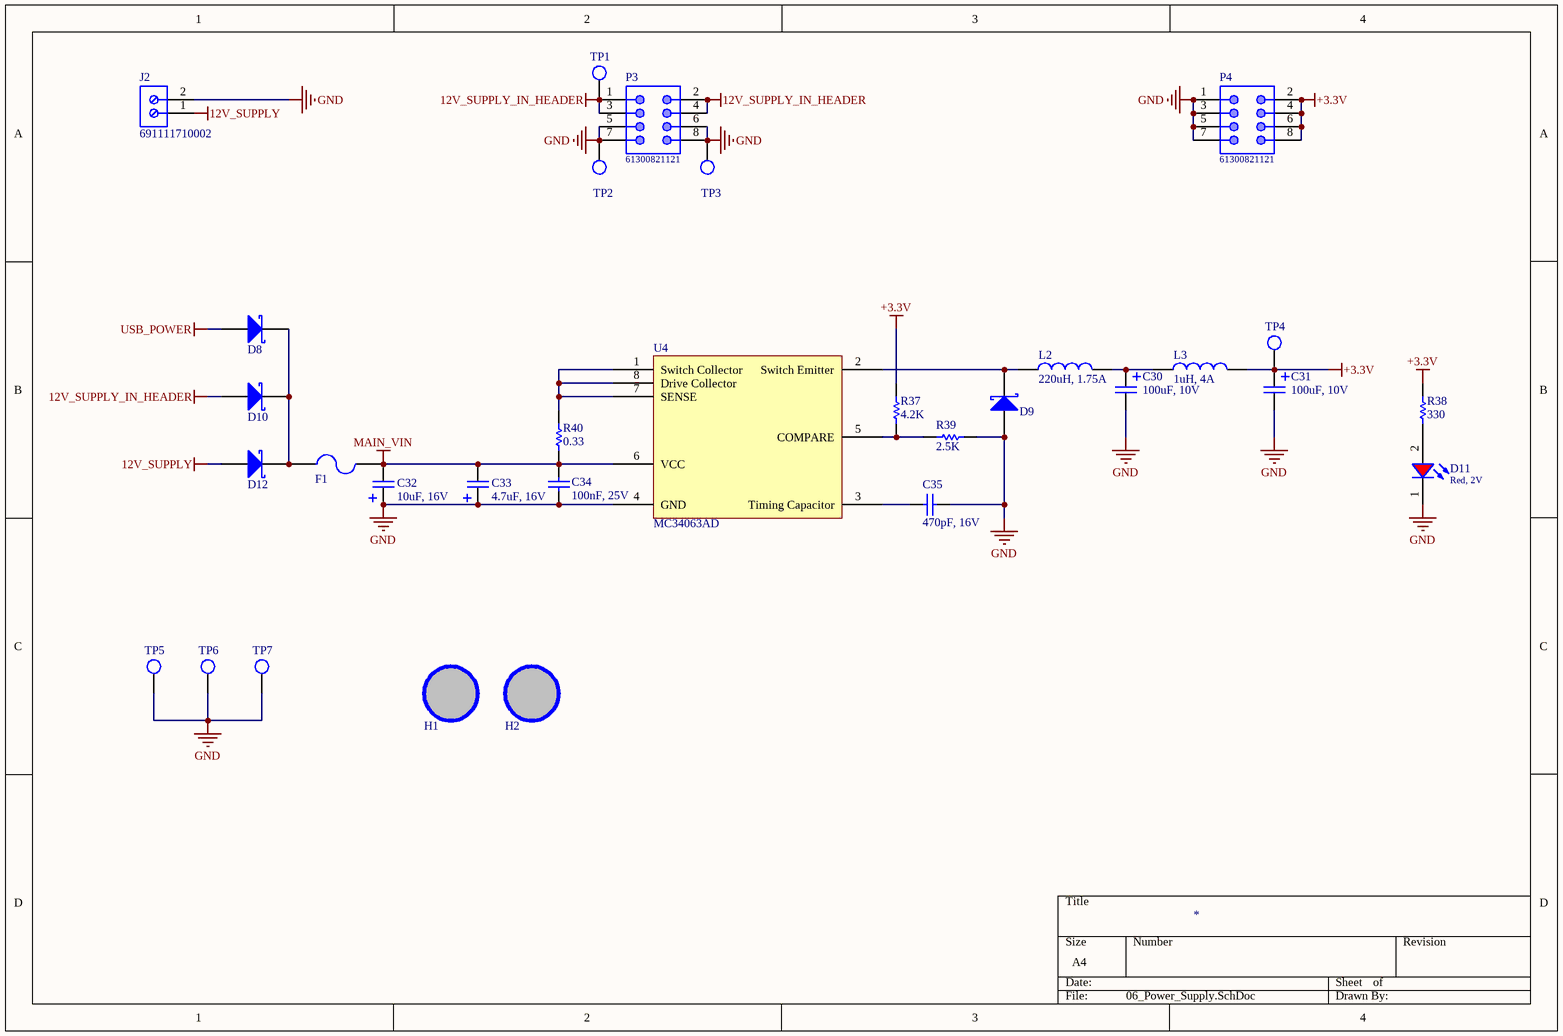
[diagram p5: 06_Power_Supply.SchDoc]

### Parts
(Parts that share a designator on the sheet are numbered #1, #2 ... from top to bottom, then left to right.)
C30  value 100uF, 10V  [TAN1210]  (hidden comment: Tantalum Capacitor)
C31  value 100uF, 10V  [TAN1210]  (hidden comment: Tantalum Capacitor)
C32  value 10uF, 16V  [TAN1206]  (hidden comment: Tantalum Capacitor)
C33  value 4.7uF, 16V  [TAN1206]  (hidden comment: Tantalum Capacitor)
C34  100nF, 25V  [WCAP-CSGP_0603_H=0.8mm_Reflow]
C35  470pF, 16V  [WCAP-CSGP_0603_H=0.8mm_Reflow]
D8  D Schottky  [SS34]  (value not drawn)
D9  D Schottky  [SS34]  (value not drawn)
D10  D Schottky  [SS34]  (value not drawn)
D11  Red, 2V  [WL-SMCW_0603_H=0.7mm]
D12  D Schottky  [SS34]  (value not drawn)
F1  Fuse  [FUSE SMD]  (value not drawn)
H1  Hole  [LO KHOAN 3MM]  (value not drawn)
H2  Hole  [LO KHOAN 3MM]  (value not drawn)
J2#2  691111710002  [691111710002]
L2  220uH, 1.75A  [WE-PD2A_5848]
L3  1uH, 4A  [WE-PD2A_4532]
P3  61300821121  [61300821121]
P4  61300821121  [61300821121]
R37  value 4.2K  [RES-SM-0603]  (hidden comment: RESISTOR SMD)
R38  value 330  [RES-SM-0603]  (hidden comment: RESISTOR SMD)
R39  value 2.5K  [RES-SM-0603]  (hidden comment: RESISTOR SMD)
R40  value 0.33  [RES-SM-0805]  (hidden comment: RESISTOR SMD)
TP1  Test point  [TP]  (value not drawn)
TP2  Test point  [TP]  (value not drawn)
TP3  Test point  [TP]  (value not drawn)
TP4  Test point  [TP]  (value not drawn)
TP5  Test point  [TP]  (value not drawn)
TP6  Test point  [TP]  (value not drawn)
TP7  Test point  [TP]  (value not drawn)
U4  MC34063AD  [SOIC127P600X170-8N]

### Nets
12V_SUPPLY: D12.1(A) J2#2.1
12V_SUPPLY_IN_HEADER: D10.1(A) P3.1 P3.2 P3.3 P3.4 TP1.1
+3.3V: C31.1 L3.2 P4.2 P4.4 P4.6 P4.8 R37.2 R38.2 TP4.1
GND: C30.2 C31.2 C32.1 C33.1 C34.1 C35.2 D9.1(A) D11.1(K) J2#2.2 P3.5 P3.6 P3.7 P3.8 P4.1 P4.3 P4.5 P4.7 R39.1 TP2.1 TP3.1 TP5.1 TP6.1 TP7.1 U4.4(GND)
MAIN_VIN: C32.2 C33.2 C34.2 F1.2 R40.1 U4.6(VCC)
USB_POWER: D8.1(A)
NetC30_1: C30.1 L2.2 L3.1
NetC35_1: C35.1 U4.3(Timing_Capacitor)
NetD8_2: D8.2(K) D10.2(K) D12.2(K) F1.1
NetD9_2: D9.2(K) L2.1 U4.2(Switch_Emitter)
NetD11_2: D11.2(A) R38.1
NetR37_1: R37.1 R39.2 U4.5(COMPARE)
NetR40_2: R40.2 U4.1(Switch_Collector) U4.7(SENSE) U4.8(Drive_Collector)

Not connected (* = marked no-connect by the designer): H1 1; H2 1

### Library data of the parts
C34 = 885012206071: WCAP-CSGP Multilayer Ceramic Chip Capacitor, General Purpose, size 0603, X7R, 100nF, 25V; Manufacturer: Wurth Elektronik; Rated Voltage: 25VDC; Isolation Resistance: >=5GOhm; Capacitance Tolerance: +/-10%; Technical Reference: X7R0603104K025DFCT10000; ComponentLink1Description: Manufacturer; ComponentLink1URL: http://www.we-online.de; ComponentLink2Description: Datasheet; ComponentLink2URL: https://www.we-online.com/catalog/datasheet/885012206071.pdf; Operating Temperature: -55 to +125degC; Packaging: Tape and Reel; Manufacturer Part Number: 885012206071; Published Date: May 2020; Ceramic Type: X7R; Dissipation Factor: =<3.5%; Height: 0.8mm; Mounting Technology: SMT; Size: 0603; Capacitance: 100nF
C35 = 885012006027: WCAP-CSGP Multilayer Ceramic Chip Capacitor, General Purpose, size 0603, NP0, 470pF, 16V; Manufacturer: Wurth Elektronik; Rated Voltage: 16VDC; Isolation Resistance: >=10GOhm; Capacitance Tolerance: +/-5%; Dissipation Factor: Q>=1000; Technical Reference: NP00603471J016DFCT10000; ComponentLink1Description: Manufacturer; ComponentLink1URL: http://www.we-online.de; ComponentLink2Description: Datasheet; ComponentLink2URL: https://www.we-online.com/catalog/datasheet/885012006027.pdf; Operating Temperature: -55 to +125degC; Packaging: Tape and Reel; Manufacturer Part Number: 885012006027; Published Date: May 2020; Ceramic Type: NP0; Height: 0.8mm; Mounting Technology: SMT; Size: 0603; Capacitance: 470pF
D8-D10 D12 = D Schottky: Schottky Diode; Published: 8-Jun-2000; LatestRevisionDate: 17-Jul-2002; LatestRevisionNote: Re-released for DXP Platform.; PackageReference: SMB; Publisher: Altium Limited; PackageDescription: DO-214-AA/SMB; 2 C-Bend Leads; Body 5.3 x 3.6 mm, inc. leads (LxW); Code_JEDEC: DO-214-AA
D11 = 150060RS75000: as D4 on sheet 03_MCU_ESP32_Interface; Viewing Angle: 140deg; ComponentLink1Description: Manufacturer; ComponentLink1URL: http://www.we-online.de; ComponentLink2URL: https://www.we-online.com/catalog/datasheet/150060RS75000.pdf; ComponentLink2Description: Datasheet; Forward Voltage typ.: 2V; Emitting Color: Red; Mounting Technology: SMT; Operating Temperature: -40 to +85degC; Published Date: December 2019; Part Number: 150060RS75000; Packaging: Tape and Reel; Size: 0603; Publisher: Wurth Elektronik
H1 H2 = Hole: Hole 3mm
J2#2 = 691111710002: WR-TBL Serie 111 Horizontal Entry Modular, Pressure Clamp, pitch 5mm, 2p; Compliance: Lead free / RoHS; Modularity: Yes; PCB/Cable/Panel: PCB; Pin Number: 2; Rated Current [UL]: 15A; Working Voltage [UL]: 250VAC; ComponentLink1Description: Manufacturer; ComponentLink1URL: http://www.we-online.de; ComponentLink2URL: https://katalog.we-online.de/em/datasheet/691111710002.pdf; ComponentLink2Description: Datasheet; Mounting Technology: THT; Part Number: 691111710002; Packaging: Box; Operating Temperature: -40 to +105degC; Pitch: 5mm; Published Date: October 2019; Type: Horizontal; Publisher: Wurth Elektronik; Application: Pressure Clamp
L2 = 784774222: WE-PD2A SMT Power Inductor, size 5848, 220uH, 0.41A; Manufacturer: Wurth Elektronik; DC Resistance max.: 1.57Ohm; Saturation Current: 0.47A; Self Resonant Frequency: 5MHz; DC Resistance typ.: 0.945Ohm; Rated Voltage: 80VDC; ComponentLink1Description: Manufacturer; ComponentLink1URL: http://www.we-online.de; ComponentLink2Description: Datasheet; ComponentLink2URL: https://www.we-online.com/catalog/datasheet/784774222.pdf; Manufacturer Part Number: 784774222; Published Date: May 2020; Rated Current: 0.41A; Inductance: 220uH; Operating Temperature: -40 to +125degC; Mounting Technology: SMT; Packaging: Tape and Reel; Size: 5848
L3 = 7847730: WE-PD2A SMT Power Inductor, size 4532, 1uH, 4A; Manufacturer: Wurth Elektronik; DC Resistance max.: 0.049Ohm; Saturation Current: 5.72A; Self Resonant Frequency: 110MHz; DC Resistance typ.: 0.014Ohm; Rated Voltage: 80VDC; ComponentLink1Description: Manufacturer; ComponentLink1URL: http://www.we-online.de; ComponentLink2Description: Datasheet; ComponentLink2URL: https://www.we-online.com/catalog/datasheet/7847730.pdf; Manufacturer Part Number: 7847730; Published Date: May 2020; Rated Current: 4A; Inductance: 1uH; Operating Temperature: -40 to +125degC; Mounting Technology: SMT; Packaging: Tape and Reel; Size: 4532
P3 P4 = 61300821121: WR-PHD Pin Header, THT, pitch 2.54mm, Dual Row, Vertical, 8p; Manufacturer: Wurth Elektronik; Pin Number: 8; Rated Current: 3A; Working Voltage: 250VAC; Withstanding Voltage: 500VAC; Contact Resistance: 20mOhm; ComponentLink1Description: Manufacturer; ComponentLink1URL: http://www.we-online.de; ComponentLink2Description: Datasheet; ComponentLink2URL: https://www.we-online.com/catalog/datasheet/61300821121.pdf; Manufacturer Part Number: 61300821121; Published Date: May 2020; Pitch: 2.54mm; Operating Temperature: -40 to +105degC; Mounting Technology: THT; Packaging: Bag; Gender: Pin Header; Row Number: Dual; Orientation: Vertical
R37-R40 = RESISTOR SMD: Resistor
TP1-TP7 = TP: ComponentLink1Description: Supplier 1 Link
U4 = MC34063: 1.5-A boost, buck, inverting switching regulator, operation from 0°C to 70°C; Manufacturer: Texas Instruments; ComponentLink1Description: Local Supplier Link; ComponentLink1URL: https://www.thegioiic.com/products/mc34063ad-ic-dieu-chinh-tang-giam-ap-1-5a-8-soic; Local Supplier: Thegioiic; Local Supplier P/N: MC34063AD; Manufacturer P/N: MC34063AD

## Sheet 07_ADC.SchDoc
size A4
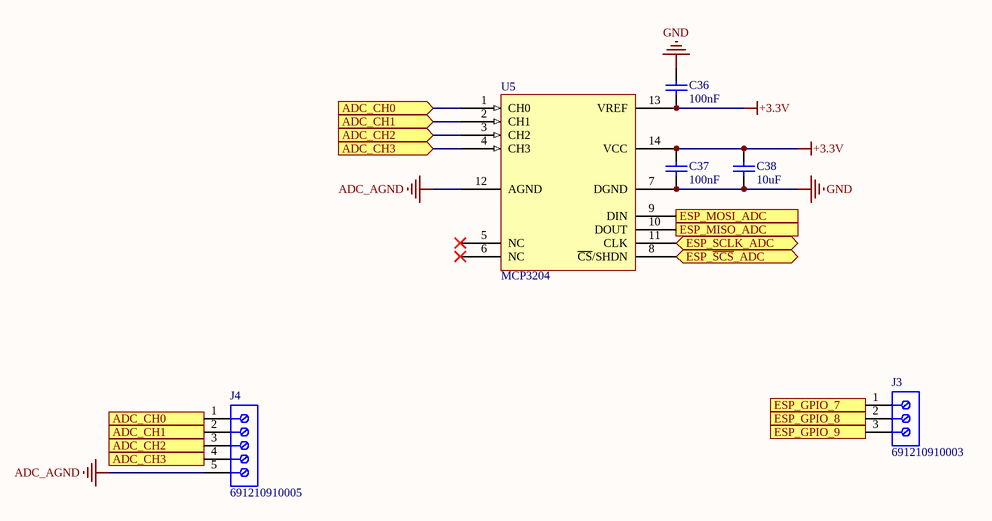
[diagram p6: 07_ADC.SchDoc]

### Parts
C36  value 100nF  [C0402]  (hidden comment: Capacitor)
C37  value 100nF  [C0402]  (hidden comment: Capacitor)
C38  value 10uF  [C0402]  (hidden comment: Capacitor)
J3  691210910003  [691210910003]
J4  691210910005  [691210910005]
U5  MCP3204  [MCP3204-14N]

### Ports
ADC_CH0 (in), ADC_CH0 (out), ADC_CH1 (in), ADC_CH1 (out), ADC_CH2 (in), ADC_CH2 (out), ADC_CH3 (in), ADC_CH3 (out), ESP_GPIO_7 (in), ESP_GPIO_8 (in), ESP_GPIO_9 (in), ESP_MISO_ADC (out), ESP_MOSI_ADC (in), ESP_SCLK_ADC (bidir), ESP_~{SCS}_ADC (bidir)

### Nets
+3.3V: C36.1 C37.2 C38.2 U5.13(VREF) U5.14(VCC)
ADC_AGND: J4.5 U5.12(AGND)
GND: C36.2 C37.1 C38.1 U5.7(DGND)
NetJ3_1: J3.1 ; port ESP_GPIO_7
NetJ3_2: J3.2 ; port ESP_GPIO_8
NetJ3_3: J3.3 ; port ESP_GPIO_9
NetJ4_1: J4.1 U5.1(CH0) ; port ADC_CH0
NetJ4_2: J4.2 U5.2(CH1) ; port ADC_CH1
NetJ4_3: J4.3 U5.3(CH2) ; port ADC_CH2
NetJ4_4: J4.4 U5.4(CH3) ; port ADC_CH3
NetU5_8: U5.8(~{CS}/SHDN) ; port ESP_~{SCS}_ADC
NetU5_9: U5.9(DIN) ; port ESP_MOSI_ADC
NetU5_10: U5.10(DOUT) ; port ESP_MISO_ADC
NetU5_11: U5.11(CLK) ; port ESP_SCLK_ADC

Not connected (* = marked no-connect by the designer): U5 5(NC)* 6(NC)*

### Library data of the parts
J3 = 691210910003: WR-TBL Serie 2109 Horizontal Entry, Rising Cage Clamp, pitch 2.54mm, 3p; Compliance: Lead free / RoHS; Modularity: No; PCB/Cable/Panel: PCB; Pin Number: 3; Rated Current [UL]: 6A; Working Voltage [UL]: 150VAC; ComponentLink1Description: Manufacturer; ComponentLink1URL: http://www.we-online.de; ComponentLink2URL: https://katalog.we-online.de/em/datasheet/691210910003.pdf; ComponentLink2Description: Datasheet; Mounting Technology: THT; Part Number: 691210910003; Packaging: Box; Operating Temperature: -40 to +105degC; Pitch: 2.54mm; Published Date: October 2019; Type: Horizontal; Publisher: Wurth Elektronik; Application: Rising Cage Clamp
J4 = 691210910005: WR-TBL Serie 2109 Horizontal Entry, Rising Cage Clamp, pitch 2.54mm, 5p; Compliance: Lead free / RoHS; Modularity: No; PCB/Cable/Panel: PCB; Pin Number: 5; Rated Current [UL]: 6A; Working Voltage [UL]: 150VAC; ComponentLink1Description: Manufacturer; ComponentLink1URL: http://www.we-online.de; ComponentLink2URL: https://katalog.we-online.de/em/datasheet/691210910005.pdf; ComponentLink2Description: Datasheet; Mounting Technology: THT; Part Number: 691210910005; Packaging: Box; Operating Temperature: -40 to +105degC; Pitch: 2.54mm; Published Date: October 2019; Type: Horizontal; Publisher: Wurth Elektronik; Application: Rising Cage Clamp

## Sheet 08_IO.SchDoc
size A4
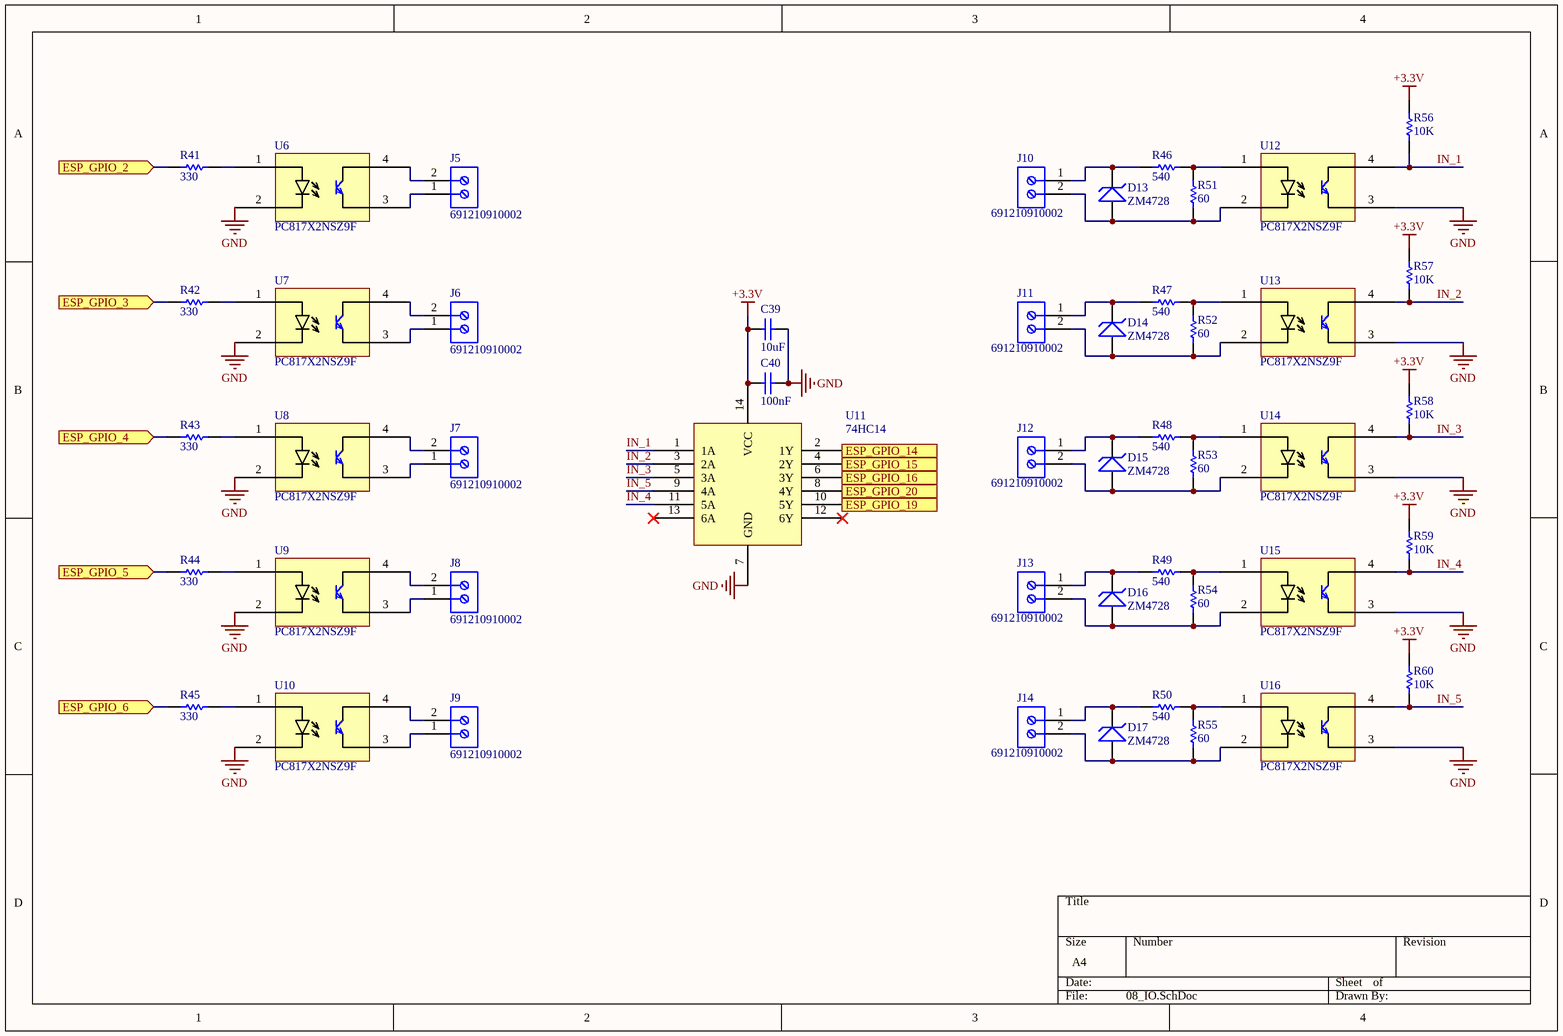
[diagram p7: 08_IO.SchDoc]

### Parts
C39  value 10uF  [C0402]  (hidden comment: Capacitor)
C40  value 100nF  [C0402]  (hidden comment: Capacitor)
D13  ZM4728  [DIOMELF3515N]
D14  ZM4728  [DIOMELF3515N]
D15  ZM4728  [DIOMELF3515N]
D16  ZM4728  [DIOMELF3515N]
D17  ZM4728  [DIOMELF3515N]
J5  691210910002  [691210910002]
J6  691210910002  [691210910002]
J7  691210910002  [691210910002]
J8  691210910002  [691210910002]
J9  691210910002  [691210910002]
J10  691210910002  [691210910002]
J11  691210910002  [691210910002]
J12  691210910002  [691210910002]
J13  691210910002  [691210910002]
J14  691210910002  [691210910002]
R41  value 330  [R0402]  (hidden comment: Resistor)
R42  value 330  [R0402]  (hidden comment: Resistor)
R43  value 330  [R0402]  (hidden comment: Resistor)
R44  value 330  [R0402]  (hidden comment: Resistor)
R45  value 330  [R0402]  (hidden comment: Resistor)
R46  value 540  [R0402]  (hidden comment: Resistor)
R47  value 540  [R0402]  (hidden comment: Resistor)
R48  value 540  [R0402]  (hidden comment: Resistor)
R49  value 540  [R0402]  (hidden comment: Resistor)
R50  value 540  [R0402]  (hidden comment: Resistor)
R51  value 60  [R0402]  (hidden comment: Resistor)
R52  value 60  [R0402]  (hidden comment: Resistor)
R53  value 60  [R0402]  (hidden comment: Resistor)
R54  value 60  [R0402]  (hidden comment: Resistor)
R55  value 60  [R0402]  (hidden comment: Resistor)
R56  value 10K  [R0402]  (hidden comment: Resistor)
R57  value 10K  [R0402]  (hidden comment: Resistor)
R58  value 10K  [R0402]  (hidden comment: Resistor)
R59  value 10K  [R0402]  (hidden comment: Resistor)
R60  value 10K  [R0402]  (hidden comment: Resistor)
U6  PC817X2NSZ9F  [PC817X2NSZ9F]
U7  PC817X2NSZ9F  [PC817X2NSZ9F]
U8  PC817X2NSZ9F  [PC817X2NSZ9F]
U9  PC817X2NSZ9F  [PC817X2NSZ9F]
U10  PC817X2NSZ9F  [PC817X2NSZ9F]
U11  74HC14  [SOIC108P600X170-14N]
U12  PC817X2NSZ9F  [PC817X2NSZ9F]
U13  PC817X2NSZ9F  [PC817X2NSZ9F]
U14  PC817X2NSZ9F  [PC817X2NSZ9F]
U15  PC817X2NSZ9F  [PC817X2NSZ9F]
U16  PC817X2NSZ9F  [PC817X2NSZ9F]

### Ports
ESP_GPIO_2 (in), ESP_GPIO_3 (in), ESP_GPIO_4 (in), ESP_GPIO_5 (in), ESP_GPIO_6 (in), ESP_GPIO_14 (out), ESP_GPIO_15 (out), ESP_GPIO_16 (out), ESP_GPIO_19 (out), ESP_GPIO_20 (out)

### Nets
+3.3V: C39.1 C40.1 R56.2 R57.2 R58.2 R59.2 R60.2 U11.14(VCC)
GND: C39.2 C40.2 U6.2(CATHODE) U7.2(CATHODE) U8.2(CATHODE) U9.2(CATHODE) U10.2(CATHODE) U11.7(GND) U12.3(CATHODE) U13.3(CATHODE) U14.3(CATHODE) U15.3(CATHODE) U16.3(CATHODE)
IN_1: R56.1 U11.1(1A) U12.4(CATHODE)
IN_2: R57.1 U11.3(2A) U13.4(CATHODE)
IN_3: R58.1 U11.5(3A) U14.4(CATHODE)
IN_4: R59.1 U11.11(5A) U15.4(CATHODE)
IN_5: R60.1 U11.9(4A) U16.4(CATHODE)
NetD13_1: D13.1 J10.1 R46.1
NetD13_2: D13.2 J10.2 R51.1 U12.2(CATHODE)
NetD14_1: D14.1 J11.1 R47.1
NetD14_2: D14.2 J11.2 R52.1 U13.2(CATHODE)
NetD15_1: D15.1 J12.1 R48.1
NetD15_2: D15.2 J12.2 R53.1 U14.2(CATHODE)
NetD16_1: D16.1 J13.1 R49.1
NetD16_2: D16.2 J13.2 R54.1 U15.2(CATHODE)
NetD17_1: D17.1 J14.1 R50.1
NetD17_2: D17.2 J14.2 R55.1 U16.2(CATHODE)
NetJ5_1: J5.1 U6.3(CATHODE)
NetJ5_2: J5.2 U6.4(CATHODE)
NetJ6_1: J6.1 U7.3(CATHODE)
NetJ6_2: J6.2 U7.4(CATHODE)
NetJ7_1: J7.1 U8.3(CATHODE)
NetJ7_2: J7.2 U8.4(CATHODE)
NetJ8_1: J8.1 U9.3(CATHODE)
NetJ8_2: J8.2 U9.4(CATHODE)
NetJ9_1: J9.1 U10.3(CATHODE)
NetJ9_2: J9.2 U10.4(CATHODE)
NetR41_1: R41.1 ; port ESP_GPIO_2
NetR41_2: R41.2 U6.1(ANOTHE)
NetR42_1: R42.1 ; port ESP_GPIO_3
NetR42_2: R42.2 U7.1(ANOTHE)
NetR43_1: R43.1 ; port ESP_GPIO_4
NetR43_2: R43.2 U8.1(ANOTHE)
NetR44_1: R44.1 ; port ESP_GPIO_5
NetR44_2: R44.2 U9.1(ANOTHE)
NetR45_1: R45.1 ; port ESP_GPIO_6
NetR45_2: R45.2 U10.1(ANOTHE)
NetR46_2: R46.2 R51.2 U12.1(ANOTHE)
NetR47_2: R47.2 R52.2 U13.1(ANOTHE)
NetR48_2: R48.2 R53.2 U14.1(ANOTHE)
NetR49_2: R49.2 R54.2 U15.1(ANOTHE)
NetR50_2: R50.2 R55.2 U16.1(ANOTHE)
NetU11_2: U11.2(1Y) ; port ESP_GPIO_14
NetU11_4: U11.4(2Y) ; port ESP_GPIO_15
NetU11_6: U11.6(3Y) ; port ESP_GPIO_16
NetU11_8: U11.8(4Y) ; port ESP_GPIO_20
NetU11_10: U11.10(5Y) ; port ESP_GPIO_19

Not connected (* = marked no-connect by the designer): U11 12(6Y)* 13(6A)*

### Library data of the parts
J5-J14 = 691210910002: WR-TBL Serie 2109 Horizontal Entry, Rising Cage Clamp, pitch 2.54mm, 2p; Compliance: Lead free / RoHS; Modularity: No; PCB/Cable/Panel: PCB; Pin Number: 2; Rated Current [UL]: 6A; Working Voltage [UL]: 150VAC; ComponentLink1Description: Manufacturer; ComponentLink1URL: http://www.we-online.de; ComponentLink2URL: https://katalog.we-online.de/em/datasheet/691210910002.pdf; ComponentLink2Description: Datasheet; Mounting Technology: THT; Part Number: 691210910002; Packaging: Box; Operating Temperature: -40 to +105degC; Pitch: 2.54mm; Published Date: October 2019; Type: Horizontal; Publisher: Wurth Elektronik; Application: Rising Cage Clamp

## Nets that join several sheets
+3.3V: 03_MCU_ESP32_Interface (13 pins), 04_ESP32_UART (6 pins), 05_Ethernet_Interface (R33.2), 06_Power_Supply (9 pins), 07_ADC (5 pins), 08_IO (8 pins)
GND: 03_MCU_ESP32_Interface (19 pins), 04_ESP32_UART (7 pins), 05_Ethernet_Interface (6 pins), 06_Power_Supply (24 pins), 07_ADC (C36.2 C37.1 C38.1 U5.7), 08_IO (13 pins)
USB_POWER: 04_ESP32_UART (D6.2 D7.4 J1#2.1), 06_Power_Supply (D8.1)
ESP_GPIO_0: 03_MCU_ESP32_Interface (5 pins), 04_ESP32_UART (R15.2)
ESP_GPIO_34: 03_MCU_ESP32_Interface (U1.28), 05_Ethernet_Interface (U3.32)
ESP_GPIO_35: 03_MCU_ESP32_Interface (U1.29), 05_Ethernet_Interface (U3.35)
ESP_GPIO_36: 03_MCU_ESP32_Interface (U1.30), 05_Ethernet_Interface (U3.33)
ESP_GPIO_37: 03_MCU_ESP32_Interface (U1.31), 05_Ethernet_Interface (U3.34)
ESP_RST: 03_MCU_ESP32_Interface (7 pins), 04_ESP32_UART (R10.2)
NetU1_37: 03_MCU_ESP32_Interface (U1.37), 04_ESP32_UART (U2.25)
NetU1_38: 03_MCU_ESP32_Interface (U1.38), 04_ESP32_UART (U2.26)